# EAGLE schematic NoiseGen_1 (EAGLE 9.5.2)
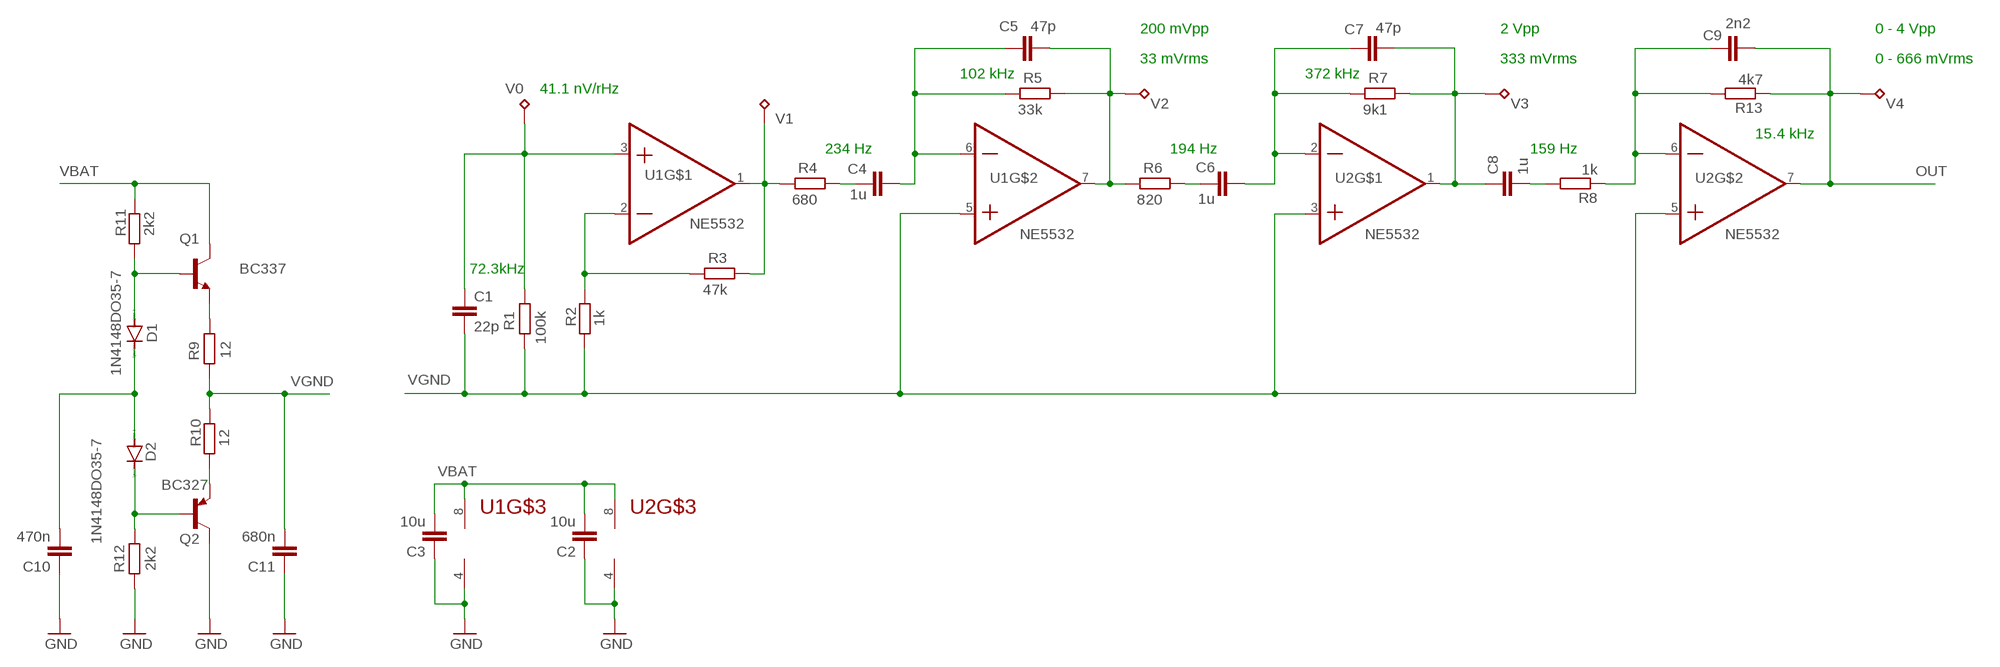
[diagram p0: schematic, sheet 1]

## Parts
C1  22p  C-EUC0805  [C0805]
C2  10u  C-EUC0805  [C0805]
C3  10u  C-EUC0805  [C0805]
C4  1u  C-EUC0805  [C0805]
C5  47p  C-EUC0805  [C0805]
C6  1u  C-EUC0805  [C0805]
C7  47p  C-EUC0805  [C0805]
C8  1u  C-EUC0805  [C0805]
C9  2n2  C-EUC0805  [C0805]
C10  470n  C-EUC0805  [C0805]
C11  680n  C-EUC0805  [C0805]
D1  1N4148DO35-7  [DO35-7]
D2  1N4148DO35-7  [DO35-7]
Q1  BC337  [TO92]
Q2  BC327  [TO92]
R1  100k  R-EU_R0805  [R0805]
R2  1k  R-EU_R0805  [R0805]
R3  47k  R-EU_R0805  [R0805]
R4  680  R-EU_R0805  [R0805]
R5  33k  R-EU_R0805  [R0805]
R6  820  R-EU_R0805  [R0805]
R7  9k1  R-EU_R0805  [R0805]
R8  1k  R-EU_R0805  [R0805]
R9  12  R-EU_R0805  [R0805]
R10  12  R-EU_R0805  [R0805]
R11  2k2  R-EU_R0805  [R0805]
R12  2k2  R-EU_R0805  [R0805]
R13  4k7  R-EU_R0805  [R0805]
U1  NE5532  [DIL-8]
U2  NE5532  [DIL-8]
V0  TESTPAD  [TESTPAD]
V1  TESTPAD  [TESTPAD]
V2  TESTPAD  [TESTPAD]
V3  TESTPAD  [TESTPAD]
V4  TESTPAD  [TESTPAD]

## Nets
GND: C2.1 C3.1 C10.1 C11.1 Q2.3(C) R12.2 U1.4(VN) U2.4(VN)
N$1: C10.2 D1.C D2.A
N$2: C1.1 R1.2 U1.3(+IN) V0.P$1(TP)
N$3: R2.2 R3.2 U1.2(-IN)
N$4: C4.1 R4.1
N$5: R3.1 R4.2 U1.1(OUT) V1.P$1(TP)
N$6: C5.2 R5.1 R6.2 U1.7(OUT) V2.P$1(TP)
N$7: C4.2 C5.1 R5.2 U1.6(-IN)
N$8: C6.2 C7.1 R7.2 U2.2(-IN)
N$9: C6.1 R6.1
N$10: C7.2 C8.1 R7.1 U2.1(OUT) V3.P$1(TP)
N$11: C8.2 R8.2
N$12: C9.1 R8.1 R13.2 U2.6(-IN)
N$13: D1.A Q1.2(B) R11.2
N$14: D2.C Q2.2(B) R12.1
N$15: Q2.1(E) R10.2
N$17: Q1.1(E) R9.2
OUT: C9.2 R13.1 U2.7(OUT) V4.P$1(TP)
VBAT: C2.2 C3.2 Q1.3(C) R11.1 U1.8(VP) U2.8(VP)
VGND: C1.2 C11.2 R1.1 R2.1 R9.1 R10.1 U1.5(+IN) U2.3(+IN) U2.5(+IN)

## Notes on the sheet
- 200 mVpp | 2 Vpp | 0 - 4 Vpp
- 33 mVrms | 333 mVrms | 0 - 666 mVrms
- 102 kHz | 372 kHz
- 41.1 nV/rHz
- 15.4 kHz
- 234 Hz | 194 Hz | 159 Hz
- 72.3kHz

## Library data of the parts
C1-C11 = rcl:C-EU: CAPACITOR, European symbol; SPICEPREFIX: C
D1 D2 = diode:1N4148: DIODE high speed (Philips)
Q1 = transistor:BC337: NPN TRANSISTOR
Q2 = transistor-pnp:BC327: PNP Transistor
R1-R13 = rcl:R-EU_: RESISTOR, European symbol; SPICEPREFIX: R
U1 U2 = RZEDKA_2017:NE5532
V0 V1-V4 = RZEDKA_2017:TESTPAD